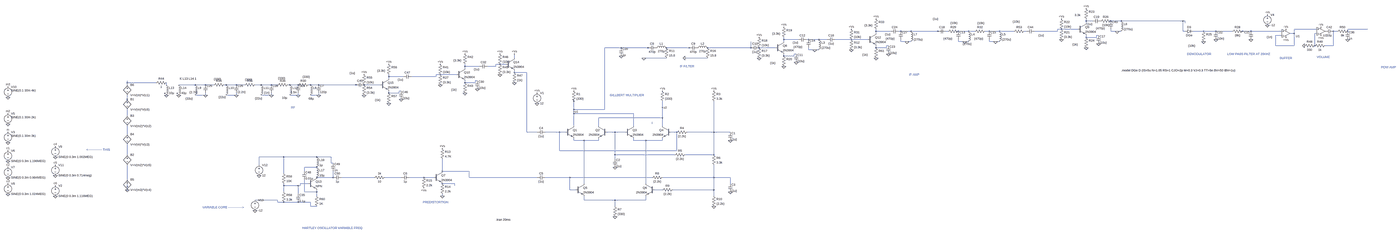
[diagram p0: schematic ΑΜ_superhet.asc, whole sheet]
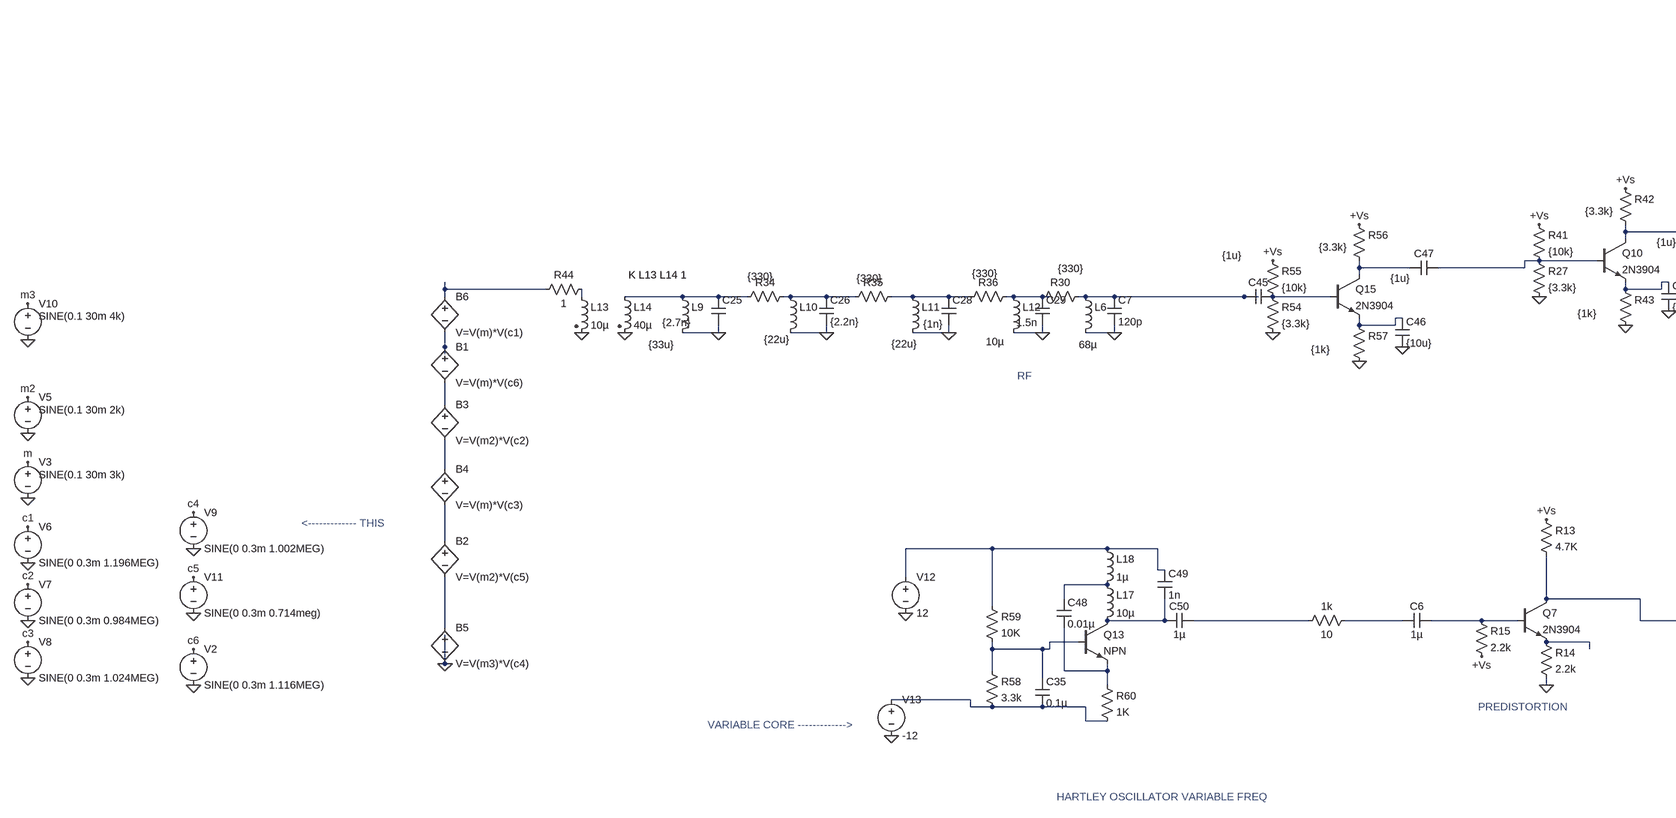
[diagram p1: schematic ΑΜ_superhet.asc, part, row 1 of 1, column 1 of 3]
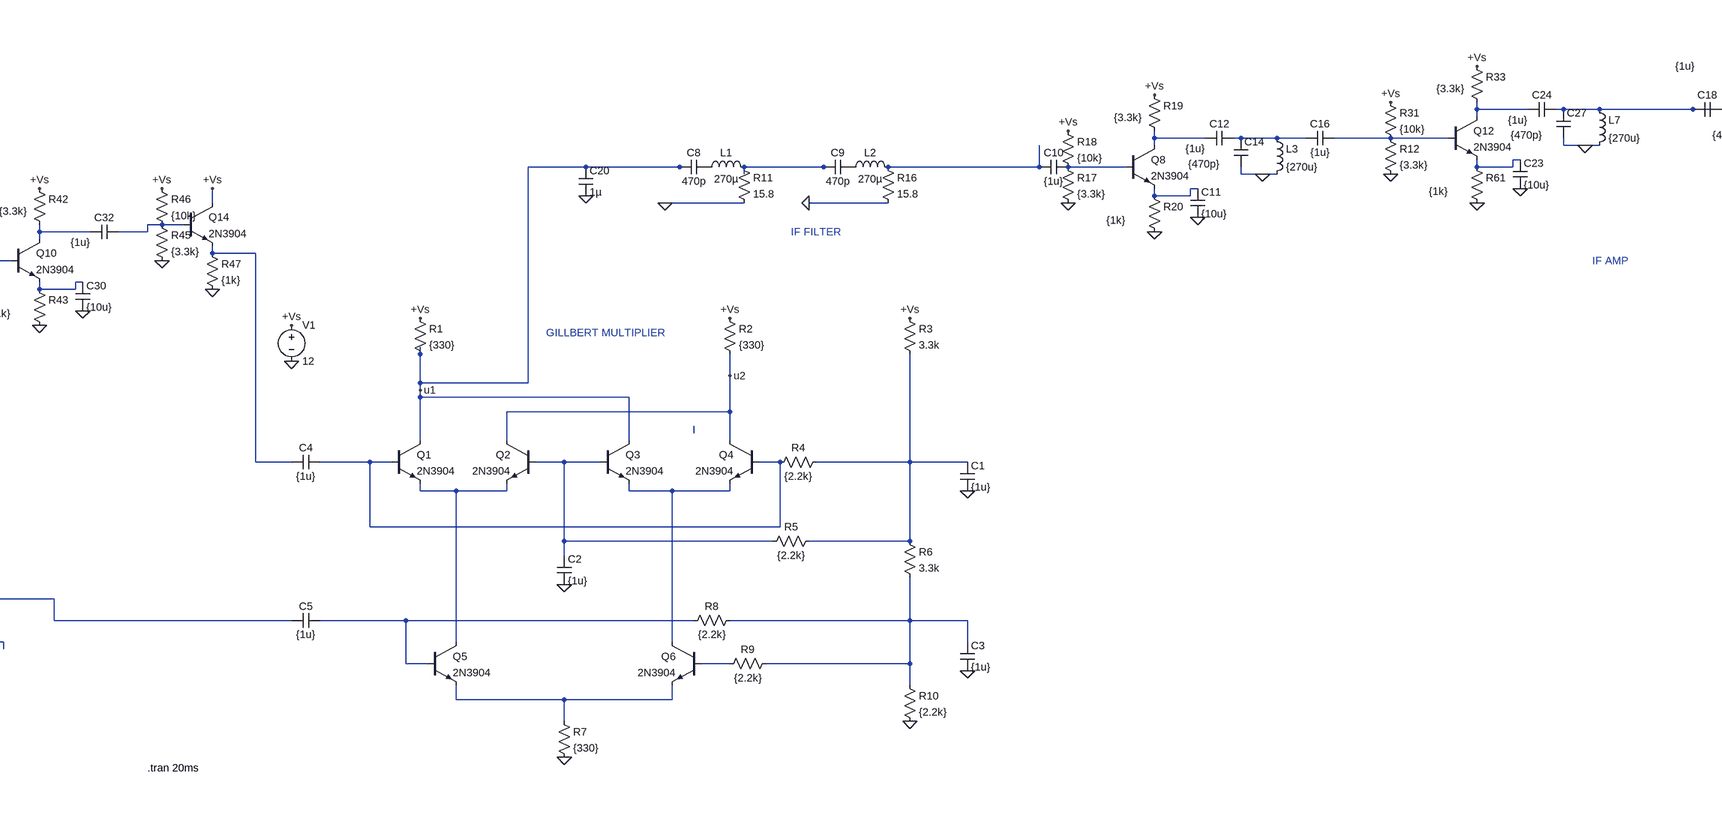
[diagram p2: schematic ΑΜ_superhet.asc, part, row 1 of 1, column 2 of 3]
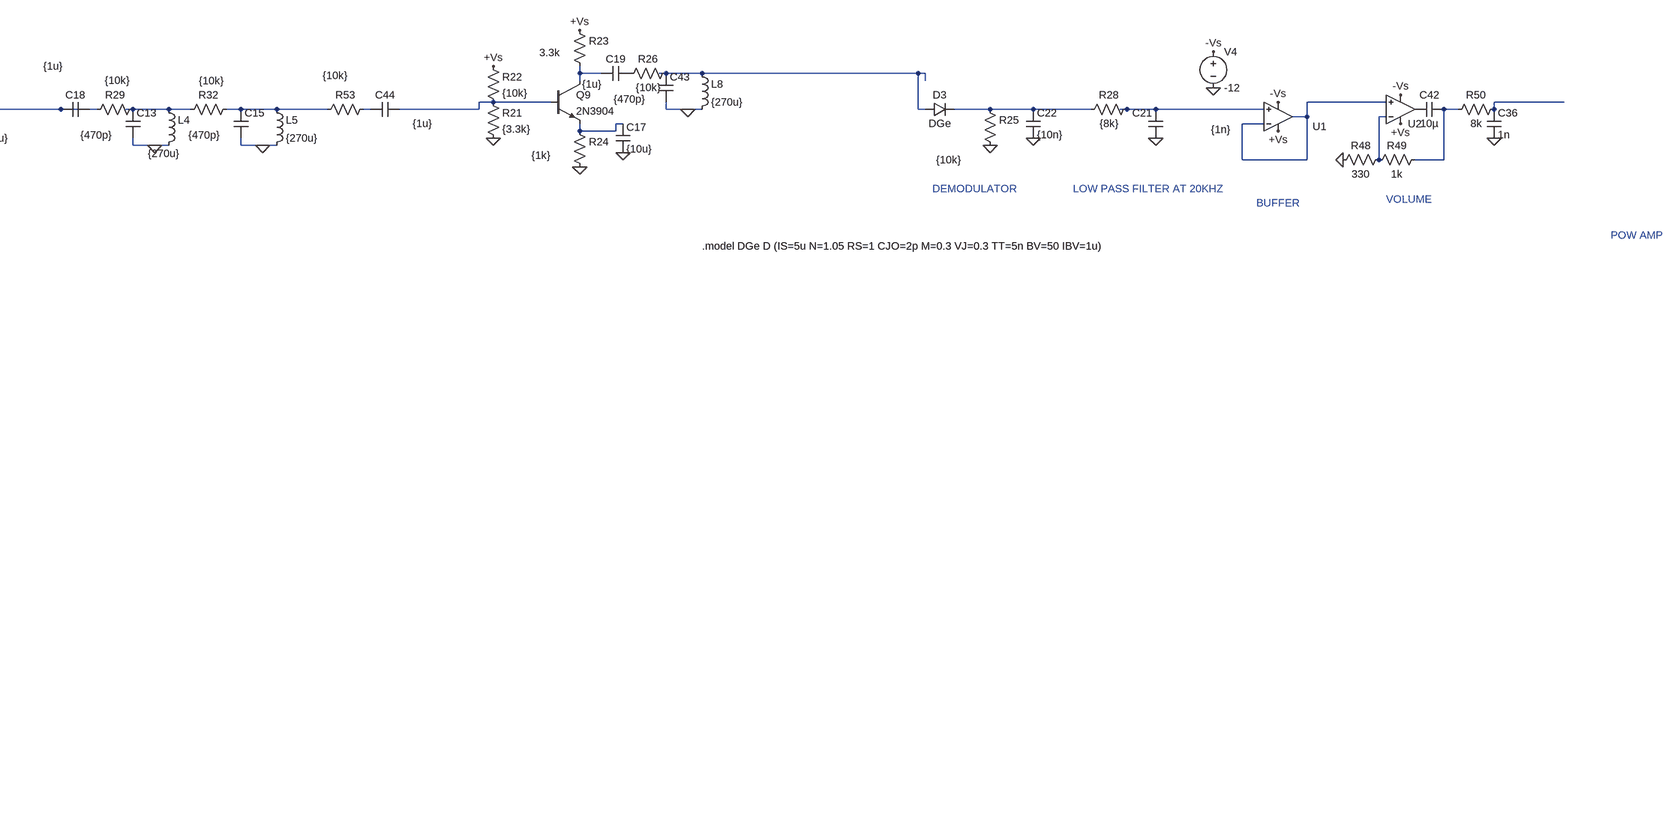
[diagram p3: schematic ΑΜ_superhet.asc, part, row 1 of 1, column 3 of 3]
ΑΜ_superhet.asc, the LTspice schematic file:
Version 4
SHEET 1 7220 1460
WIRE 4480 -608 4480 -624
WIRE 4528 -608 4480 -608
WIRE 4672 -608 4656 -608
WIRE 4752 -608 4672 -608
WIRE 5232 -608 4752 -608
WIRE 5248 -608 5232 -608
WIRE 4480 -592 4480 -608
WIRE 5248 -592 5248 -608
WIRE 4288 -544 4256 -544
WIRE 4416 -544 4288 -544
WIRE 6272 -544 6096 -544
WIRE 6736 -544 6512 -544
WIRE 2704 -528 2704 -544
WIRE 2816 -528 2704 -528
WIRE 2896 -528 2880 -528
WIRE 2976 -528 2896 -528
WIRE 3184 -528 2976 -528
WIRE 3232 -528 3184 -528
WIRE 3264 -528 3248 -528
WIRE 3344 -528 3328 -528
WIRE 3424 -528 3344 -528
WIRE 3472 -528 3424 -528
WIRE 3584 -528 3552 -528
WIRE 3664 -528 3584 -528
WIRE 3776 -528 3664 -528
WIRE 3872 -528 3856 -528
WIRE 4256 -528 4256 -544
WIRE 4256 -528 3936 -528
WIRE 4672 -528 4672 -544
WIRE 4720 -528 4672 -528
WIRE 4752 -528 4720 -528
WIRE 5232 -528 5232 -608
WIRE 5248 -528 5232 -528
WIRE 5392 -528 5312 -528
WIRE 5488 -528 5392 -528
WIRE 5616 -528 5488 -528
WIRE 5696 -528 5680 -528
WIRE 5760 -528 5696 -528
WIRE 6000 -528 5760 -528
WIRE 6432 -528 6400 -528
WIRE 6512 -528 6512 -544
WIRE 2704 -512 2704 -528
WIRE 6096 -512 6096 -544
WIRE 6096 -512 6064 -512
WIRE 6272 -512 6256 -512
WIRE 4576 -496 4560 -496
WIRE 6000 -496 5952 -496
WIRE 4480 -480 4480 -496
WIRE 4560 -480 4560 -496
WIRE 4560 -480 4480 -480
WIRE 1824 -464 1824 -480
WIRE 1936 -464 1824 -464
WIRE 2016 -464 2000 -464
WIRE 2096 -464 2016 -464
WIRE 2160 -464 2096 -464
WIRE 2512 -464 2224 -464
WIRE 2640 -464 2512 -464
WIRE 1824 -448 1824 -464
WIRE 2896 -448 2896 -464
WIRE 2944 -448 2896 -448
WIRE 2976 -448 2944 -448
WIRE 3344 -448 3344 -464
WIRE 3392 -448 3344 -448
WIRE 3424 -448 3392 -448
WIRE 3584 -448 3584 -464
WIRE 3632 -448 3584 -448
WIRE 3664 -448 3632 -448
WIRE 2800 -416 2784 -416
WIRE 5952 -416 5952 -496
WIRE 6096 -416 6096 -512
WIRE 6096 -416 5952 -416
WIRE 6256 -416 6256 -512
WIRE 6400 -416 6400 -528
WIRE 6400 -416 6336 -416
WIRE 512 -400 384 -400
WIRE 720 -400 512 -400
WIRE 736 -400 720 -400
WIRE 1040 -400 864 -400
WIRE 1056 -400 1040 -400
WIRE 1568 -400 1568 -448
WIRE 1568 -400 1184 -400
WIRE 1584 -400 1568 -400
WIRE 1760 -400 1632 -400
WIRE 2704 -400 2704 -416
WIRE 2784 -400 2784 -416
WIRE 2784 -400 2704 -400
WIRE 864 -384 864 -400
WIRE 2016 -384 2016 -400
WIRE 2064 -384 2016 -384
WIRE 2096 -384 2064 -384
WIRE 1920 -352 1904 -352
WIRE 1824 -336 1824 -352
WIRE 1904 -336 1904 -352
WIRE 1904 -336 1824 -336
WIRE -368 -320 -368 -352
WIRE 688 -320 672 -320
WIRE 864 -320 688 -320
WIRE 1184 -320 1008 -320
WIRE -480 -272 -512 -272
WIRE -432 -272 -480 -272
WIRE -752 -256 -752 -272
WIRE -640 -256 -752 -256
WIRE -512 -256 -512 -272
WIRE -512 -256 -576 -256
WIRE -752 -240 -752 -256
WIRE -368 -208 -368 -224
WIRE -272 -208 -368 -208
WIRE -944 -192 -976 -192
WIRE -816 -192 -944 -192
WIRE -1344 -176 -1344 -192
WIRE -1232 -176 -1344 -176
WIRE -976 -176 -976 -192
WIRE -976 -176 -1168 -176
WIRE -1344 -160 -1344 -176
WIRE -656 -144 -672 -144
WIRE -3376 -128 -3376 -144
WIRE -3152 -128 -3376 -128
WIRE -752 -128 -752 -144
WIRE -672 -128 -672 -144
WIRE -672 -128 -752 -128
WIRE -3376 -112 -3376 -128
WIRE -3072 -112 -3072 -128
WIRE -2848 -112 -2976 -112
WIRE -2768 -112 -2848 -112
WIRE -2704 -112 -2768 -112
WIRE -2608 -112 -2624 -112
WIRE -2528 -112 -2608 -112
WIRE -2464 -112 -2528 -112
WIRE -2336 -112 -2384 -112
WIRE -2256 -112 -2336 -112
WIRE -2208 -112 -2256 -112
WIRE -2112 -112 -2128 -112
WIRE -2048 -112 -2112 -112
WIRE -2032 -112 -2048 -112
WIRE -1952 -112 -1968 -112
WIRE -1888 -112 -1952 -112
WIRE -1600 -112 -1888 -112
WIRE -1568 -112 -1600 -112
WIRE -1408 -112 -1536 -112
WIRE -1248 -64 -1264 -64
WIRE -1344 -48 -1344 -64
WIRE -1264 -48 -1264 -64
WIRE -1264 -48 -1344 -48
WIRE -2768 -32 -2768 -48
WIRE -2768 -32 -2848 -32
WIRE -2528 -32 -2528 -48
WIRE -2528 -32 -2608 -32
WIRE -2256 -32 -2256 -48
WIRE -2256 -32 -2336 -32
WIRE -2048 -32 -2048 -48
WIRE -2048 -32 -2112 -32
WIRE -1888 -32 -1888 -48
WIRE -1888 -32 -1952 -32
WIRE -3376 0 -3376 -32
WIRE -3376 16 -3376 0
WIRE 144 16 144 0
WIRE 832 64 832 16
WIRE 144 80 144 16
WIRE 384 80 384 -400
WIRE 384 80 144 80
WIRE 144 96 144 80
WIRE 144 112 144 96
WIRE 608 112 144 112
WIRE -3376 128 -3376 80
WIRE 832 144 832 64
WIRE 832 144 336 144
WIRE 752 192 752 176
WIRE 144 208 144 112
WIRE 336 208 336 144
WIRE 608 208 608 112
WIRE 832 208 832 144
WIRE -272 256 -272 -208
WIRE -192 256 -272 256
WIRE 32 256 -128 256
WIRE 80 256 32 256
WIRE 464 256 400 256
WIRE 544 256 464 256
WIRE 944 256 896 256
WIRE 1232 256 1232 16
WIRE 1232 256 1024 256
WIRE 1360 256 1232 256
WIRE -3376 272 -3376 208
WIRE 144 320 144 304
WIRE 224 320 144 320
WIRE 336 320 336 304
WIRE 336 320 224 320
WIRE 608 320 608 304
WIRE 704 320 608 320
WIRE 832 320 832 304
WIRE 832 320 704 320
WIRE 32 400 32 256
WIRE 944 400 944 256
WIRE 944 400 32 400
WIRE -3376 432 -3376 352
WIRE 464 432 464 256
WIRE 928 432 464 432
WIRE 1232 432 1232 256
WIRE 1232 432 1008 432
WIRE -2160 448 -2352 448
WIRE -1904 448 -2160 448
WIRE -1792 448 -1904 448
WIRE 464 464 464 432
WIRE -1792 496 -1792 448
WIRE -1776 496 -1792 496
WIRE -2352 512 -2352 448
WIRE -1904 528 -2000 528
WIRE -2000 560 -2000 528
WIRE -928 560 -928 464
WIRE -720 560 -928 560
WIRE -2160 576 -2160 448
WIRE -1776 608 -1776 560
WIRE -1776 608 -1904 608
WIRE -1456 608 -1712 608
WIRE -1248 608 -1376 608
WIRE -1072 608 -1184 608
WIRE -992 608 -1072 608
WIRE -720 608 -720 560
WIRE -192 608 -720 608
WIRE 112 608 -128 608
WIRE 752 608 112 608
WIRE 1232 608 1232 512
WIRE 1232 608 832 608
WIRE 1360 608 1232 608
WIRE -3376 624 -3376 512
WIRE -1968 656 -2032 656
WIRE -832 656 -928 656
WIRE 224 656 224 320
WIRE 704 656 704 320
WIRE 1360 656 1360 608
WIRE -2160 672 -2160 656
WIRE -2048 672 -2160 672
WIRE -2032 672 -2032 656
WIRE -2032 672 -2048 672
WIRE -832 672 -832 656
WIRE -3376 704 -3376 640
WIRE -3376 704 -3392 704
WIRE 112 704 112 608
WIRE 160 704 112 704
WIRE 832 704 768 704
WIRE 1232 704 1232 608
WIRE 1232 704 912 704
WIRE -2160 720 -2160 672
WIRE -2000 720 -2000 624
WIRE -1904 720 -1904 704
WIRE -1904 720 -2000 720
WIRE -2048 736 -2048 672
WIRE -1904 752 -1904 720
WIRE -928 752 -928 736
WIRE 1232 752 1232 704
WIRE -2208 784 -2384 784
WIRE 224 784 224 752
WIRE 464 784 224 784
WIRE 704 784 704 752
WIRE 704 784 464 784
WIRE -2208 800 -2208 784
WIRE -2160 800 -2208 800
WIRE -2048 800 -2160 800
WIRE -1952 800 -2048 800
WIRE -1952 832 -1952 800
WIRE -1904 832 -1952 832
WIRE 464 832 464 784
FLAG -192 32 0
FLAG -192 -48 +Vs
FLAG 144 -64 +Vs
FLAG 832 -64 +Vs
FLAG 1232 -64 +Vs
FLAG 1360 320 0
FLAG 464 528 0
FLAG 464 912 0
FLAG 1360 720 0
FLAG 1232 832 0
FLAG 832 64 u2
FLAG 144 96 u1
FLAG -928 384 +Vs
FLAG -928 752 0
FLAG -1072 688 +Vs
FLAG 688 -320 0
FLAG 1008 -320 0
FLAG 1632 -320 0
FLAG 1824 -256 0
FLAG 1920 -288 0
FLAG 1632 -480 +Vs
FLAG 1824 -560 +Vs
FLAG 5392 -448 0
FLAG 5488 -464 0
FLAG 2064 -384 0
FLAG 5760 -464 0
FLAG -2768 -32 0
FLAG -2528 -32 0
FLAG -2256 -32 0
FLAG -2048 -32 0
FLAG -4368 256 m
FLAG -4368 336 0
FLAG -4368 400 c1
FLAG -4368 528 c2
FLAG -4368 656 c3
FLAG -4368 480 0
FLAG -4368 608 0
FLAG -4368 736 0
FLAG -4000 448 0
FLAG -4000 368 c4
FLAG -3376 704 0
FLAG -3072 -32 0
FLAG -2976 -32 0
FLAG -4000 592 0
FLAG -4000 512 c5
FLAG -4000 752 0
FLAG -4000 672 c6
FLAG -480 -192 0
FLAG -368 -128 0
FLAG -480 -352 +Vs
FLAG -368 -352 +Vs
FLAG 6032 -480 +Vs
FLAG 5888 -576 0
FLAG 5888 -656 -Vs
FLAG 6032 -544 -Vs
FLAG 6176 -416 0
FLAG 6304 -560 -Vs
FLAG 6304 -496 +Vs
FLAG 6512 -464 0
FLAG -4368 112 m2
FLAG -4368 192 0
FLAG -4368 -96 m3
FLAG -4368 -16 0
FLAG 512 -336 0
FLAG -2352 592 0
FLAG -2384 864 0
FLAG -1888 -32 0
FLAG 2512 -384 0
FLAG 2704 -320 0
FLAG 2800 -352 0
FLAG 2512 -544 +Vs
FLAG 2704 -624 +Vs
FLAG 2944 -448 0
FLAG 3392 -448 0
FLAG 3632 -448 0
FLAG 4288 -464 0
FLAG 4480 -400 0
FLAG 4576 -432 0
FLAG 4288 -624 +Vs
FLAG 4480 -704 +Vs
FLAG 4720 -528 0
FLAG -1536 -32 0
FLAG -1344 32 0
FLAG -1248 0 0
FLAG -1536 -192 +Vs
FLAG -1344 -272 +Vs
FLAG -944 -112 0
FLAG -752 -48 0
FLAG -656 -80 0
FLAG -944 -272 +Vs
FLAG -752 -352 +Vs
DATAFLAG -928 544 ""
DATAFLAG -912 656 ""
DATAFLAG -1008 608 ""
DATAFLAG 112 608 ""
DATAFLAG 224 608 ""
DATAFLAG 224 784 ""
DATAFLAG 704 784 ""
DATAFLAG 704 640 ""
DATAFLAG 800 704 ""
DATAFLAG 160 320 ""
DATAFLAG 64 256 ""
DATAFLAG 336 176 ""
DATAFLAG 384 144 ""
DATAFLAG 560 144 ""
DATAFLAG 608 192 ""
DATAFLAG 768 320 ""
DATAFLAG 832 176 ""
DATAFLAG 5776 -528 ""
SYMBOL res 128 -80 R0
SYMATTR InstName R1
SYMATTR Value {330}
SYMBOL res 816 -80 R0
SYMATTR InstName R2
SYMATTR Value {330}
SYMBOL voltage -192 -64 R0
WINDOW 123 0 0 Left 0
WINDOW 39 0 0 Left 0
SYMATTR InstName V1
SYMATTR Value 12
SYMBOL npn 80 208 R0
SYMATTR InstName Q1
SYMATTR Value 2N3904
SYMBOL npn 400 208 M0
SYMATTR InstName Q2
SYMATTR Value 2N3904
SYMBOL npn 544 208 R0
SYMATTR InstName Q3
SYMATTR Value 2N3904
SYMBOL npn 896 208 M0
SYMATTR InstName Q4
SYMATTR Value 2N3904
SYMBOL res 1216 -80 R0
SYMATTR InstName R3
SYMATTR Value 3.3k
SYMBOL res 1040 240 R90
WINDOW 0 0 56 VBottom 2
WINDOW 3 32 56 VTop 2
SYMATTR InstName R4
SYMATTR Value {2.2k}
SYMBOL cap 1344 256 R0
SYMATTR InstName C1
SYMATTR Value {1u}
SYMBOL cap 448 464 R0
SYMATTR InstName C2
SYMATTR Value {1u}
SYMBOL res 1024 416 R90
WINDOW 0 0 56 VBottom 2
WINDOW 3 32 56 VTop 2
SYMATTR InstName R5
SYMATTR Value {2.2k}
SYMBOL res 1216 416 R0
SYMATTR InstName R6
SYMATTR Value 3.3k
SYMBOL npn 160 656 R0
SYMATTR InstName Q5
SYMATTR Value 2N3904
SYMBOL npn 768 656 M0
SYMATTR InstName Q6
SYMATTR Value 2N3904
SYMBOL res 448 816 R0
SYMATTR InstName R7
SYMATTR Value {330}
SYMBOL res 848 592 R90
WINDOW 0 0 56 VBottom 2
WINDOW 3 32 56 VTop 2
SYMATTR InstName R8
SYMATTR Value {2.2k}
SYMBOL res 928 688 R90
WINDOW 0 0 56 VBottom 2
WINDOW 3 32 56 VTop 2
SYMATTR InstName R9
SYMATTR Value {2.2k}
SYMBOL cap 1344 656 R0
SYMATTR InstName C3
SYMATTR Value {1u}
SYMBOL res 1216 736 R0
SYMATTR InstName R10
SYMATTR Value {2.2k}
SYMBOL cap -128 240 R90
WINDOW 0 0 32 VBottom 2
WINDOW 3 32 32 VTop 2
SYMATTR InstName C4
SYMATTR Value {1u}
SYMBOL cap -128 592 R90
WINDOW 0 0 32 VBottom 2
WINDOW 3 32 32 VTop 2
SYMATTR InstName C5
SYMATTR Value {1u}
SYMBOL npn -992 560 R0
SYMATTR InstName Q7
SYMATTR Value 2N3904
SYMBOL res -944 368 R0
SYMATTR InstName R13
SYMATTR Value 4.7K
SYMBOL res -944 640 R0
SYMATTR InstName R14
SYMATTR Value 2.2k
SYMBOL res -1088 592 R0
SYMATTR InstName R15
SYMATTR Value 2.2k
SYMBOL cap 784 -416 R90
WINDOW 0 0 32 VBottom 2
WINDOW 3 32 32 VTop 2
SYMATTR InstName C8
SYMATTR Value 470p
SYMBOL ind 768 -384 R270
WINDOW 0 32 56 VTop 2
WINDOW 3 5 56 VBottom 2
SYMATTR InstName L1
SYMATTR Value 270µ
SYMBOL res 848 -416 R0
SYMATTR InstName R11
SYMATTR Value 15.8
SYMBOL cap 1104 -416 R90
WINDOW 0 0 32 VBottom 2
WINDOW 3 32 32 VTop 2
SYMATTR InstName C9
SYMATTR Value 470p
SYMBOL cap 1632 -416 R90
WINDOW 0 0 32 VBottom 2
WINDOW 3 32 32 VTop 2
SYMATTR InstName C10
SYMATTR Value {1u}
SYMBOL res 1616 -416 R0
SYMATTR InstName R17
SYMATTR Value {3.3k}
SYMBOL res 1616 -496 R0
SYMATTR InstName R18
SYMATTR Value {10k}
SYMBOL res 1168 -416 R0
SYMATTR InstName R16
SYMATTR Value 15.8
SYMBOL ind 1088 -384 R270
WINDOW 0 32 56 VTop 2
WINDOW 3 5 56 VBottom 2
SYMATTR InstName L2
SYMATTR Value 270µ
SYMBOL npn 1760 -448 R0
SYMATTR InstName Q8
SYMATTR Value 2N3904
SYMBOL res 1808 -576 R0
WINDOW 3 -74 66 Left 2
SYMATTR Value {3.3k}
SYMATTR InstName R19
SYMBOL res 1808 -352 R0
WINDOW 3 -91 70 Left 2
SYMATTR Value {1k}
SYMATTR InstName R20
SYMBOL cap 1904 -352 R0
SYMATTR InstName C11
SYMATTR Value {10u}
SYMBOL cap 2000 -480 R90
WINDOW 0 0 32 VBottom 2
WINDOW 3 24 85 VTop 2
SYMATTR InstName C12
SYMATTR Value {1u}
SYMBOL res 5376 -544 R0
WINDOW 3 -104 128 Left 2
SYMATTR Value {10k}
SYMATTR InstName R25
SYMBOL cap 2000 -464 R0
WINDOW 3 -101 57 Left 2
SYMATTR Value {470p}
SYMATTR InstName C14
SYMBOL ind 2080 -480 R0
SYMATTR InstName L3
SYMATTR Value {270u}
SYMBOL cap 2224 -480 R90
WINDOW 0 0 32 VBottom 2
WINDOW 3 32 32 VTop 2
SYMATTR InstName C16
SYMATTR Value {1u}
SYMBOL cap 3248 -544 R90
WINDOW 0 0 32 VBottom 2
WINDOW 3 -96 82 VTop 2
SYMATTR InstName C18
SYMATTR Value {1u}
SYMBOL res 5600 -512 R270
WINDOW 0 32 56 VTop 2
WINDOW 3 0 56 VBottom 2
SYMATTR InstName R28
SYMATTR Value {8k}
SYMBOL cap 5776 -464 R180
WINDOW 0 24 56 Left 2
WINDOW 3 -150 19 Left 2
SYMATTR InstName C21
SYMATTR Value {1n}
SYMBOL cap 5472 -528 R0
SYMATTR InstName C22
SYMATTR Value {10n}
SYMBOL ind -2864 -128 R0
WINDOW 3 -60 123 Left 2
SYMATTR Value {33u}
SYMATTR InstName L9
SYMBOL cap -2784 -112 R0
WINDOW 3 -109 58 Left 2
SYMATTR Value {2.7n}
SYMATTR InstName C25
SYMBOL ind -2624 -128 R0
WINDOW 3 -43 111 Left 2
SYMATTR Value {22u}
SYMATTR InstName L10
SYMBOL cap -2544 -112 R0
SYMATTR InstName C26
SYMATTR Value {2.2n}
SYMBOL ind -2352 -128 R0
WINDOW 3 -32 121 Left 2
SYMATTR Value {22u}
SYMATTR InstName L11
SYMBOL cap -2272 -112 R0
WINDOW 3 -41 61 Left 2
SYMATTR Value {1n}
SYMATTR InstName C28
SYMBOL cap -2064 -112 R0
WINDOW 3 -42 58 Left 2
SYMATTR Value 1.5n
SYMATTR InstName C29
SYMBOL ind -2128 -128 R0
WINDOW 3 -46 116 Left 2
SYMATTR Value 10µ
SYMATTR InstName L12
SYMBOL res -2368 -128 R90
WINDOW 0 0 56 VBottom 2
WINDOW 3 -40 65 VTop 2
SYMATTR InstName R35
SYMATTR Value {330}
SYMBOL res -2112 -128 R90
WINDOW 0 0 56 VBottom 2
WINDOW 3 -51 64 VTop 2
SYMATTR InstName R36
SYMATTR Value {330}
SYMBOL voltage -4368 240 R0
WINDOW 123 0 0 Left 0
WINDOW 39 0 0 Left 0
WINDOW 3 24 44 Left 2
SYMATTR Value SINE(0.1 30m 3k)
SYMATTR InstName V3
SYMBOL voltage -4368 384 R0
WINDOW 123 0 0 Left 0
WINDOW 39 0 0 Left 0
SYMATTR InstName V6
SYMATTR Value SINE(0 0.3m 1.196MEG)
SYMBOL voltage -4368 512 R0
WINDOW 123 0 0 Left 0
WINDOW 39 0 0 Left 0
SYMATTR InstName V7
SYMATTR Value SINE(0 0.3m 0.984MEG)
SYMBOL voltage -4368 640 R0
WINDOW 123 0 0 Left 0
WINDOW 39 0 0 Left 0
SYMATTR InstName V8
SYMATTR Value SINE(0 0.3m 1.024MEG)
SYMBOL voltage -4000 352 R0
WINDOW 123 0 0 Left 0
WINDOW 39 0 0 Left 0
SYMATTR InstName V9
SYMATTR Value SINE(0 0.3m 1.002MEG)
SYMBOL bv -3376 112 R0
SYMATTR InstName B3
SYMATTR Value V=V(m2)*V(c2)
SYMBOL bv -3376 256 R0
SYMATTR InstName B4
SYMATTR Value V=V(m)*V(c3)
SYMBOL bv -3376 608 R0
SYMATTR InstName B5
SYMATTR Value V=V(m3)*V(c4)
SYMBOL ind2 -3088 -128 R0
SYMATTR InstName L13
SYMATTR Value 10µ
SYMATTR Type ind
SYMBOL ind2 -2992 -128 R0
SYMATTR InstName L14
SYMATTR Value 40µ
SYMATTR Type ind
SYMBOL res -3056 -144 R90
WINDOW 0 0 56 VBottom 2
WINDOW 3 32 56 VTop 2
SYMATTR InstName R44
SYMATTR Value 1
SYMBOL voltage -4000 496 R0
WINDOW 123 0 0 Left 0
WINDOW 39 0 0 Left 0
SYMATTR InstName V11
SYMATTR Value SINE(0 0.3m 0.714meg)
SYMBOL res -2608 -128 R90
WINDOW 0 0 56 VBottom 2
WINDOW 3 -44 67 VTop 2
SYMATTR InstName R34
SYMATTR Value {330}
SYMBOL voltage -4000 656 R0
WINDOW 123 0 0 Left 0
WINDOW 39 0 0 Left 0
SYMATTR InstName V2
SYMATTR Value SINE(0 0.3m 1.116MEG)
SYMBOL res -496 -288 R0
SYMATTR InstName R45
SYMATTR Value {3.3k}
SYMBOL res -496 -368 R0
SYMATTR InstName R46
SYMATTR Value {10k}
SYMBOL npn -432 -320 R0
SYMATTR InstName Q14
SYMATTR Value 2N3904
SYMBOL res -384 -224 R0
SYMATTR InstName R47
SYMATTR Value {1k}
SYMBOL OpAmps\\UniversalOpAmp2 6032 -512 M180
WINDOW 0 77 -22 Left 2
SYMATTR InstName U1
SYMBOL OpAmps\\UniversalOpAmp2 6304 -528 M180
SYMATTR InstName U2
SYMBOL voltage 5888 -672 R0
WINDOW 123 0 0 Left 0
WINDOW 39 0 0 Left 0
SYMATTR InstName V4
SYMATTR Value -12
SYMBOL res 6272 -432 R90
WINDOW 0 0 56 VBottom 2
WINDOW 3 32 56 VTop 2
SYMATTR InstName R48
SYMATTR Value 330
SYMBOL res 6352 -432 R90
WINDOW 0 0 56 VBottom 2
WINDOW 3 32 56 VTop 2
SYMATTR InstName R49
SYMATTR Value 1k
SYMBOL res 6528 -544 R90
WINDOW 0 0 56 VBottom 2
WINDOW 3 32 56 VTop 2
SYMATTR InstName R50
SYMATTR Value 8k
SYMBOL cap 6496 -528 R0
SYMATTR InstName C36
SYMATTR Value 1n
SYMBOL cap 6400 -544 R90
WINDOW 0 0 32 VBottom 2
WINDOW 3 32 32 VTop 2
SYMATTR InstName C42
SYMATTR Value 10µ
SYMBOL voltage -4368 96 R0
WINDOW 123 0 0 Left 0
WINDOW 39 0 0 Left 0
WINDOW 3 24 44 Left 2
SYMATTR Value SINE(0.1 30m 2k)
SYMATTR InstName V5
SYMBOL voltage -4368 -112 R0
WINDOW 123 0 0 Left 0
WINDOW 39 0 0 Left 0
WINDOW 3 24 44 Left 2
SYMATTR Value SINE(0.1 30m 4k)
SYMATTR InstName V10
SYMBOL cap 3872 -512 R270
WINDOW 0 32 32 VTop 2
WINDOW 3 0 115 VBottom 2
SYMATTR InstName C44
SYMATTR Value {1u}
SYMBOL res 4688 -624 R90
WINDOW 0 0 56 VBottom 2
WINDOW 3 32 56 VTop 2
SYMATTR InstName R26
SYMATTR Value {10k}
SYMBOL diode 5248 -512 R270
WINDOW 0 32 32 VTop 2
WINDOW 3 0 32 VBottom 2
SYMATTR InstName D3
SYMATTR Value DGe
SYMBOL res 3872 -544 R90
WINDOW 0 0 56 VBottom 2
WINDOW 3 -75 79 VTop 2
SYMATTR InstName R53
SYMATTR Value {10k}
SYMBOL res 3360 -544 R90
WINDOW 0 0 56 VBottom 2
WINDOW 3 -64 51 VTop 2
SYMATTR InstName R29
SYMATTR Value {10k}
SYMBOL res 3568 -544 R90
WINDOW 0 0 56 VBottom 2
WINDOW 3 -63 50 VTop 2
SYMATTR InstName R32
SYMATTR Value {10k}
SYMBOL cap 496 -400 R0
SYMATTR InstName C20
SYMATTR Value 1µ
SYMBOL npn -1968 608 R0
SYMATTR InstName Q13
SYMBOL res -2176 704 R0
SYMATTR InstName R58
SYMATTR Value 3.3k
SYMBOL res -2176 560 R0
SYMATTR InstName R59
SYMATTR Value 10K
SYMBOL res -1920 736 R0
SYMATTR InstName R60
SYMATTR Value 1K
SYMBOL cap -2064 736 R0
SYMATTR InstName C35
SYMATTR Value 0.1µ
SYMBOL cap -2016 560 R0
SYMATTR InstName C48
SYMATTR Value 0.01µ
SYMBOL ind -1920 512 R0
SYMATTR InstName L17
SYMATTR Value 10µ
SYMBOL ind -1920 432 R0
SYMATTR InstName L18
SYMATTR Value 1µ
SYMBOL cap -1792 496 R0
SYMATTR InstName C49
SYMATTR Value 1n
SYMBOL voltage -2352 496 R0
WINDOW 123 0 0 Left 0
WINDOW 39 0 0 Left 0
SYMATTR InstName V12
SYMATTR Value 12
SYMBOL voltage -2384 768 R0
WINDOW 123 0 0 Left 0
WINDOW 39 0 0 Left 0
SYMATTR InstName V13
SYMATTR Value -12
SYMBOL cap -1712 592 R90
WINDOW 0 0 32 VBottom 2
WINDOW 3 32 32 VTop 2
SYMATTR InstName C50
SYMATTR Value 1µ
SYMBOL res -1360 592 R90
WINDOW 0 0 56 VBottom 2
WINDOW 3 32 56 VTop 2
SYMATTR InstName 1k
SYMATTR Value 10
SYMBOL cap -1184 592 R90
WINDOW 0 0 32 VBottom 2
WINDOW 3 32 32 VTop 2
SYMATTR InstName C6
SYMATTR Value 1µ
SYMBOL cap -1904 -112 R0
SYMATTR InstName C7
SYMATTR Value 120p
SYMBOL ind -1968 -128 R0
WINDOW 3 1 123 Left 2
SYMATTR Value 68µ
SYMATTR InstName L6
SYMBOL res -1952 -128 R90
WINDOW 0 0 56 VBottom 2
WINDOW 3 -62 33 VTop 2
SYMATTR InstName R30
SYMATTR Value {330}
SYMBOL res 2496 -480 R0
SYMATTR InstName R12
SYMATTR Value {3.3k}
SYMBOL res 2496 -560 R0
SYMATTR InstName R31
SYMATTR Value {10k}
SYMBOL npn 2640 -512 R0
SYMATTR InstName Q12
SYMATTR Value 2N3904
SYMBOL res 2688 -640 R0
WINDOW 3 -74 66 Left 2
SYMATTR Value {3.3k}
SYMATTR InstName R33
SYMBOL res 2688 -416 R0
WINDOW 3 -91 70 Left 2
SYMATTR Value {1k}
SYMATTR InstName R61
SYMBOL cap 2784 -416 R0
SYMATTR InstName C23
SYMATTR Value {10u}
SYMBOL cap 2880 -544 R90
WINDOW 0 0 32 VBottom 2
WINDOW 3 24 85 VTop 2
SYMATTR InstName C24
SYMATTR Value {1u}
SYMBOL cap 2880 -528 R0
WINDOW 3 -101 57 Left 2
SYMATTR Value {470p}
SYMATTR InstName C27
SYMBOL ind 2960 -544 R0
SYMATTR InstName L7
SYMATTR Value {270u}
SYMBOL cap 3328 -528 R0
WINDOW 3 -101 57 Left 2
SYMATTR Value {470p}
SYMATTR InstName C13
SYMBOL ind 3408 -544 R0
WINDOW 3 -31 114 Left 2
SYMATTR Value {270u}
SYMATTR InstName L4
SYMBOL cap 3568 -528 R0
WINDOW 3 -101 57 Left 2
SYMATTR Value {470p}
SYMATTR InstName C15
SYMBOL ind 3648 -544 R0
SYMATTR InstName L5
SYMATTR Value {270u}
SYMBOL res 4272 -560 R0
SYMATTR InstName R21
SYMATTR Value {3.3k}
SYMBOL res 4272 -640 R0
SYMATTR InstName R22
SYMATTR Value {10k}
SYMBOL npn 4416 -592 R0
SYMATTR InstName Q9
SYMATTR Value 2N3904
SYMBOL res 4464 -720 R0
WINDOW 3 -74 66 Left 2
SYMATTR Value 3.3k
SYMATTR InstName R23
SYMBOL res 4464 -496 R0
WINDOW 3 -91 70 Left 2
SYMATTR Value {1k}
SYMATTR InstName R24
SYMBOL cap 4560 -496 R0
SYMATTR InstName C17
SYMATTR Value {10u}
SYMBOL cap 4592 -624 R90
WINDOW 0 0 32 VBottom 2
WINDOW 3 24 85 VTop 2
SYMATTR InstName C19
SYMATTR Value {1u}
SYMBOL cap 4656 -608 R0
WINDOW 3 -101 57 Left 2
SYMATTR Value {470p}
SYMATTR InstName C43
SYMBOL ind 4736 -624 R0
SYMATTR InstName L8
SYMATTR Value {270u}
SYMBOL cap -1536 -128 R90
WINDOW 0 0 32 VBottom 2
WINDOW 3 -91 91 VTop 2
SYMATTR InstName C45
SYMATTR Value {1u}
SYMBOL res -1552 -128 R0
SYMATTR InstName R54
SYMATTR Value {3.3k}
SYMBOL res -1552 -208 R0
SYMATTR InstName R55
SYMATTR Value {10k}
SYMBOL npn -1408 -160 R0
SYMATTR InstName Q15
SYMATTR Value 2N3904
SYMBOL res -1360 -288 R0
WINDOW 3 -74 66 Left 2
SYMATTR Value {3.3k}
SYMATTR InstName R56
SYMBOL res -1360 -64 R0
WINDOW 3 -91 70 Left 2
SYMATTR Value {1k}
SYMATTR InstName R57
SYMBOL cap -1264 -64 R0
SYMATTR InstName C46
SYMATTR Value {10u}
SYMBOL cap -1168 -192 R90
WINDOW 0 0 32 VBottom 2
WINDOW 3 24 85 VTop 2
SYMATTR InstName C47
SYMATTR Value {1u}
SYMBOL res -960 -208 R0
SYMATTR InstName R27
SYMATTR Value {3.3k}
SYMBOL res -960 -288 R0
SYMATTR InstName R41
SYMATTR Value {10k}
SYMBOL npn -816 -240 R0
SYMATTR InstName Q10
SYMATTR Value 2N3904
SYMBOL res -768 -368 R0
WINDOW 3 -74 66 Left 2
SYMATTR Value {3.3k}
SYMATTR InstName R42
SYMBOL res -768 -144 R0
WINDOW 3 -91 70 Left 2
SYMATTR Value {1k}
SYMATTR InstName R43
SYMBOL cap -672 -144 R0
SYMATTR InstName C30
SYMATTR Value {10u}
SYMBOL cap -576 -272 R90
WINDOW 0 0 32 VBottom 2
WINDOW 3 24 85 VTop 2
SYMATTR InstName C32
SYMATTR Value {1u}
SYMBOL bv -3376 -16 R0
SYMATTR InstName B1
SYMATTR Value V=V(m)*V(c6)
SYMBOL bv -3376 416 R0
SYMATTR InstName B2
SYMATTR Value V=V(m2)*V(c5)
SYMBOL bv -3376 -128 R0
SYMATTR InstName B6
SYMATTR Value V=V(m)*V(c1)
TEXT -512 936 Left 2 !.tran 20ms
TEXT 4752 -224 Left 2 !.model DGe D (IS=5u N=1.05 RS=1 CJO=2p M=0.3 VJ=0.3 TT=5n BV=50 IBV=1u)
TEXT 968 -256 Left 2 ;IF FILTER
TEXT 2960 -192 Left 2 ;IF AMP
TEXT 5264 -352 Left 2 ;DEMODULATOR
TEXT 5576 -352 Left 2 ;LOW PASS FILTER AT 20KHZ
TEXT -2016 1000 Left 2 ;HARTLEY OSCILLATOR VARIABLE FREQ
TEXT -1080 800 Left 2 ;PREDISTORTION
TEXT 424 -32 Left 2 ;GILLBERT MULTIPLIER
TEXT -2968 -160 Left 2 !K L13 L14 1
TEXT -2104 64 Left 2 ;RF
TEXT 5984 -320 Left 2 ;BUFFER
TEXT 6272 -328 Left 2 ;VOLUME
TEXT 6936 -248 Left 2 ;POW AMP
TEXT -2792 840 Left 2 ;VARIABLE CORE ------------->
TEXT -3760 392 Left 2 ;<------------- THIS

The netlist it stands for:
* ΑΜ_superhet.asc
R1 +Vs u1 {330}
R2 +Vs u2 {330}
V1 +Vs 0 12
Q1 u1 N043 N047 0 2N3904
Q2 u2 N044 N047 0 2N3904
Q3 u1 N044 N048 0 2N3904
Q4 u2 N043 N048 0 2N3904
R3 +Vs N045 3.3k
R4 N045 N043 {2.2k}
C1 N045 0 {1u}
C2 N044 0 {1u}
R5 N045 N044 {2.2k}
R6 N045 N058 3.3k
Q5 N047 N057 N065 0 2N3904
Q6 N048 N062 N065 0 2N3904
R7 N065 0 {330}
R8 N058 N057 {2.2k}
R9 N058 N062 {2.2k}
C3 N058 0 {1u}
R10 N058 0 {2.2k}
C4 N043 N027 {1u}
C5 N057 N052 {1u}
Q7 N052 N056 N061 0 2N3904
R13 +Vs N052 4.7K
R14 N061 0 2.2k
R15 N056 +Vs 2.2k
C8 P001 u1 470p
L1 P001 N021 270µ
R11 N021 0 15.8
C9 P002 N021 470p
C10 N023 N022 {1u}
R17 N023 0 {3.3k}
R18 +Vs N023 {10k}
R16 N022 0 15.8
L2 P002 N022 270µ
Q8 N017 N023 N024 0 2N3904
R19 +Vs N017 {3.3k}
R20 N024 0 {1k}
C11 N024 0 {10u}
C12 N018 N017 {1u}
R25 N012 0 {10k}
C14 N018 0 {470p}
L3 N018 0 {270u}
C16 N019 N018 {1u}
C18 N008 N007 {1u}
R28 N012 N013 {8k}
C21 0 N013 {1n}
C22 N012 0 {10n}
L9 N033 0 {33u}
C25 N033 0 {2.7n}
L10 N034 0 {22u}
C26 N034 0 {2.2n}
L11 N035 0 {22u}
C28 N035 0 {1n}
C29 N036 0 1.5n
L12 N036 0 10µ
R35 N035 N034 {330}
R36 N036 N035 {330}
V3 m 0 SINE(0.1 30m 3k)
V6 c1 0 SINE(0 0.3m 1.196MEG)
V7 c2 0 SINE(0 0.3m 0.984MEG)
V8 c3 0 SINE(0 0.3m 1.024MEG)
V9 c4 0 SINE(0 0.3m 1.002MEG)
B3 N041 N046 V=V(m2)*V(c2)
B4 N046 N049 V=V(m)*V(c3)
B5 N059 0 V=V(m3)*V(c4)
L13 N032 0 10µ
L14 N033 0 40µ
R44 N032 N031 1
V11 c5 0 SINE(0 0.3m 0.714meg)
R34 N034 N033 {330}
V2 c6 0 SINE(0 0.3m 1.116MEG)
R45 N025 0 {3.3k}
R46 +Vs N025 {10k}
Q14 +Vs N025 N027 0 2N3904
R47 N027 0 {1k}
XU1 N013 N004 +Vs -Vs N004 level2 Avol=1Meg GBW=10Meg Slew=10Meg Ilimit=25m Rail=0 Vos=0 En=0 Enk=0 In=0 Ink=0 Rin=500Meg  ; pins In+ In- V+ V- OUT
XU2 N004 N015 +Vs -Vs P003 level2 Avol=1Meg GBW=10Meg Slew=10Meg Ilimit=25m Rail=0 Vos=0 En=0 Enk=0 In=0 Ink=0 Rin=500Meg  ; pins In+ In- V+ V- OUT
V4 -Vs 0 -12
R48 N015 0 330
R49 N014 N015 1k
R50 N005 N014 8k
C36 N005 0 1n
C42 N014 P003 10µ
V5 m2 0 SINE(0.1 30m 2k)
V10 m3 0 SINE(0.1 30m 4k)
C44 N011 N003 {1u}
R26 N002 P004 {10k}
D3 N002 N012 DGe
R53 N011 N010 {10k}
R29 N009 N008 {10k}
R32 N010 N009 {10k}
C20 u1 0 1µ
Q13 N053 N060 N063 0 NPN
R58 N060 N064 3.3k
R59 N050 N060 10K
R60 N063 N064 1K
C35 N060 N064 0.1µ
C48 N051 N063 0.01µ
L17 N051 N053 10µ
L18 N050 N051 1µ
C49 N050 N053 1n
V12 N050 0 12
V13 N064 0 -12
C50 N054 N053 1µ
R§1k N055 N054 10
C6 N056 N055 1µ
C7 N037 0 120p
L6 N037 0 68µ
R30 N037 N036 {330}
R12 N019 0 {3.3k}
R31 +Vs N019 {10k}
Q12 N006 N019 N020 0 2N3904
R33 +Vs N006 {3.3k}
R61 N020 0 {1k}
C23 N020 0 {10u}
C24 N007 N006 {1u}
C27 N007 0 {470p}
L7 N007 0 {270u}
C13 N009 0 {470p}
L4 N009 0 {270u}
C15 N010 0 {470p}
L5 N010 0 {270u}
R21 N003 0 {3.3k}
R22 +Vs N003 {10k}
Q9 N001 N003 N016 0 2N3904
R23 +Vs N001 3.3k
R24 N016 0 {1k}
C17 N016 0 {10u}
C19 P004 N001 {1u}
C43 N002 0 {470p}
L8 N002 0 {270u}
C45 N038 N037 {1u}
R54 N038 0 {3.3k}
R55 +Vs N038 {10k}
Q15 N029 N038 N039 0 2N3904
R56 +Vs N029 {3.3k}
R57 N039 0 {1k}
C46 N039 0 {10u}
C47 N028 N029 {1u}
R27 N028 0 {3.3k}
R41 +Vs N028 {10k}
Q10 N026 N028 N030 0 2N3904
R42 +Vs N026 {3.3k}
R43 N030 0 {1k}
C30 N030 0 {10u}
C32 N025 N026 {1u}
B1 N040 N041 V=V(m)*V(c6)
B2 N049 N059 V=V(m2)*V(c5)
B6 N031 N040 V=V(m)*V(c1)
.model D D
.lib standard.dio
.model NPN NPN
.model PNP PNP
.lib standard.bjt
.tran 20ms
.model DGe D (IS=5u N=1.05 RS=1 CJO=2p M=0.3 VJ=0.3 TT=5n BV=50 IBV=1u)
* IF FILTER
* IF AMP
* DEMODULATOR
* LOW PASS FILTER AT 20KHZ
* HARTLEY OSCILLATOR VARIABLE FREQ
* PREDISTORTION
* GILLBERT MULTIPLIER
K L13 L14 1
* RF
* BUFFER
* VOLUME
* POW AMP
* VARIABLE CORE ------------->
* <------------- THIS
.lib UniversalOpAmp2.lib
.backanno
.end